# EAGLE design WLAN_Modem (EAGLE 9.6.2)
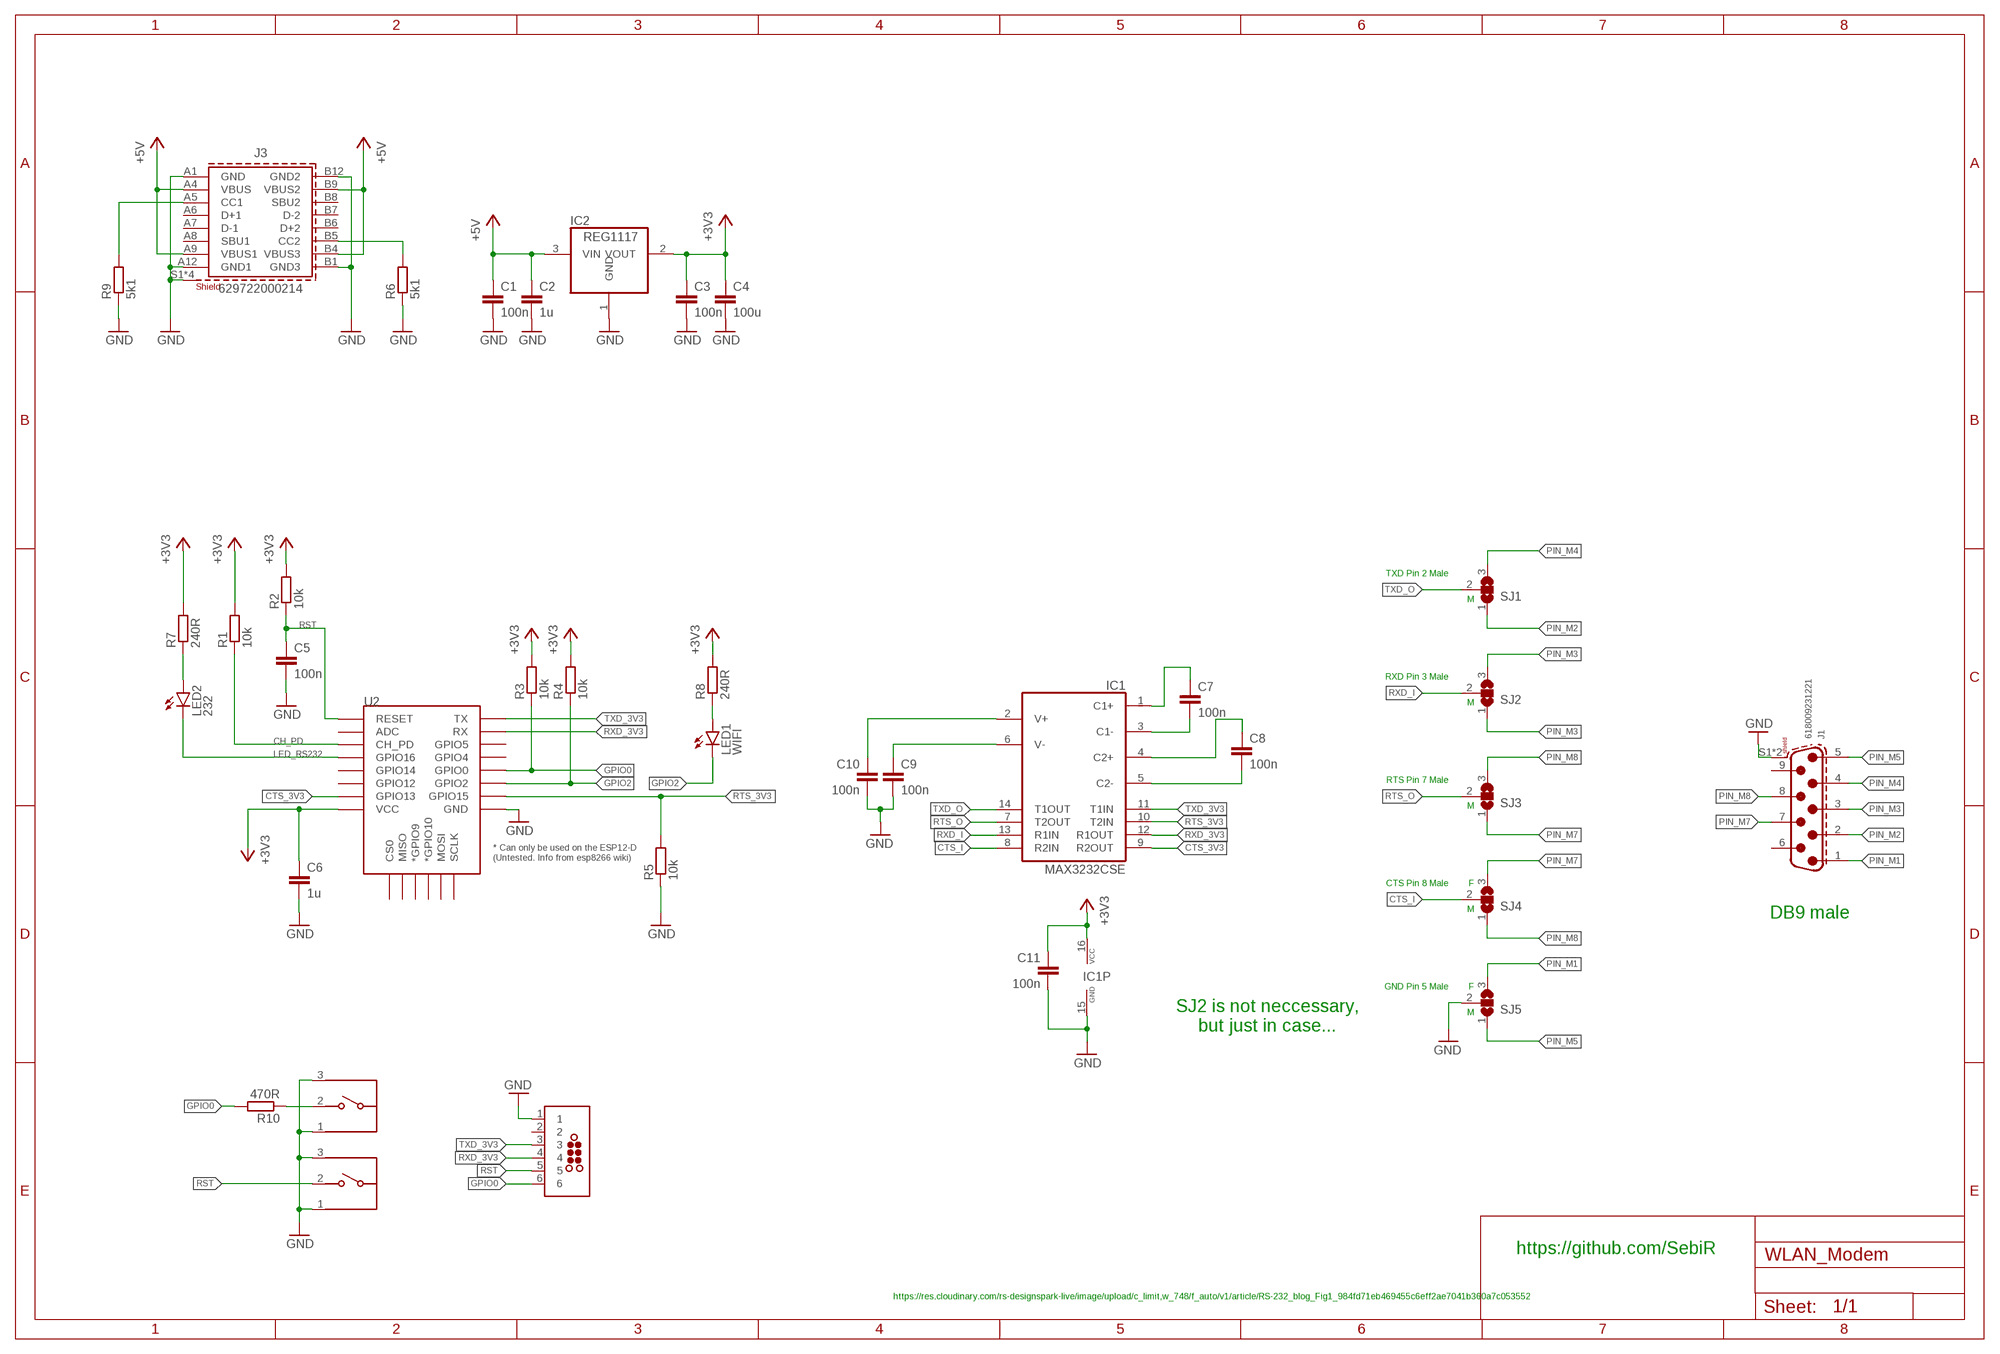
[diagram p0: schematic, sheet 1]

## Parts
C1  100n  C-EUC0603  [C0603]
C2  1u  C-EUC0603  [C0603]
C3  100n  C-EUC0603  [C0603]
C4  100u  C-EUC0603  [C0603]
C5  100n  C-EUC0603  [C0603]
C6  1u  C-EUC0603  [C0603]
C7  100n  C-EUC0603  [C0603]
C8  100n  C-EUC0603  [C0603]
C9  100n  C-EUC0603  [C0603]
C10  100n  C-EUC0603  [C0603]
C11  100n  C-EUC0603  [C0603]
IC1  MAX3232CSE  [SO16]
IC2  REG1117  [SOT223]
J1  618009231221  6180XX231221_618009231221  [618009231221]
J3  629722000214  [629722000214]
J4  TAG-CONNECT_TC2030-MCP-NL  [TAG-CONNECT_TC2030-MCP-NL]
LED1  WIFI  LEDCHIP-LED0603  [CHIP-LED0603]
LED2  232  LEDCHIP-LED0603  [CHIP-LED0603]
R1  10k  R-EU_R0603  [R0603]
R2  10k  R-EU_R0603  [R0603]
R3  10k  R-EU_R0603  [R0603]
R4  10k  R-EU_R0603  [R0603]
R5  10k  R-EU_R0603  [R0603]
R6  5k1  R-EU_R0603  [R0603]
R7  240R  R-EU_R0603  [R0603]
R8  240R  R-EU_R0603  [R0603]
R9  5k1  R-EU_R0603  [R0603]
R10  470R  R-EU_R0603  [R0603]
S1  436333033816  [436333033816]
S2  436333033816  [436333033816]
SJ1  SJ2W  [SJ_2]
SJ2  SJ2W  [SJ_2]
SJ3  SJ2W  [SJ_2]
SJ4  SJ2W  [SJ_2]
SJ5  SJ2W  [SJ_2]
U2  ESP12ESMD  [ESP12E-SMD]

## Nets
+3V3: C3.1 C4.1 C6.1 C11.1 IC1.16(VCC) IC2.2(VOUT) R1.2 R2.2 R3.2 R4.2 R7.2 R8.2 U2.VCC
+5V: C1.1 C2.1 IC2.3(VIN) J3.A4(VBUS) J3.A9(VBUS1) J3.B4(VBUS3) J3.B9(VBUS2)
CH_PD: R1.1 U2.CH_PD
CTS_3V3: IC1.9(R2OUT) U2.GPIO13
CTS_I: IC1.8(R2IN) SJ4.2
GND: C1.2 C2.2 C3.2 C4.2 C5.2 C6.2 C9.2 C10.2 C11.2 IC1.15(GND) IC2.1(GND) J1.S1(SHIELD) J1.S2(SHIELD) J3.A1(GND) J3.A12(GND1) J3.B1(GND3) J3.B12(GND2) J3.S1(SHIELD) J3.S2(SHIELD) J3.S3(SHIELD) J3.S4(SHIELD) J4.1 R5.1 R6.1 R9.1 S1.1 S1.3 S2.1 S2.3 SJ5.2 U2.GND
GPIO0: J4.6 R3.1 R10.2 U2.GPIO0
GPIO2: LED1.C R4.1 U2.GPIO2
LED_RS232: LED2.C U2.GPIO16
N$1: LED1.A R8.1
N$2: J3.A5(CC1) R9.2
N$4: LED2.A R7.1
N$5: J3.B5(CC2) R6.2
N$7: R10.1 S2.2
N$11: C7.2 IC1.3(C1-)
N$15: C7.1 IC1.1(C1+)
N$16: C8.1 IC1.4(C2+)
N$17: C8.2 IC1.5(C2-)
N$18: C10.1 IC1.2(V+)
N$19: C9.1 IC1.6(V-)
PIN_M1: J1.1 SJ5.3
PIN_M2: J1.2 SJ1.1
PIN_M3: J1.3 SJ2.1 SJ2.3
PIN_M4: J1.4 SJ1.3
PIN_M5: J1.5 SJ5.1
PIN_M7: J1.7 SJ3.1 SJ4.3
PIN_M8: J1.8 SJ3.3 SJ4.1
RST: C5.1 J4.5 R2.1 S1.2 U2.RESET
RTS_3V3: IC1.10(T2IN) R5.2 U2.GPIO15
RTS_O: IC1.7(T2OUT) SJ3.2
RXD_3V3: IC1.12(R1OUT) J4.4 U2.RXD0(RX)
RXD_I: IC1.13(R1IN) SJ2.2
TXD_3V3: IC1.11(T1IN) J4.3 U2.TXD0(TX)
TXD_O: IC1.14(T1OUT) SJ1.2
Unconnected: J1.6 J1.9 J3.A6(D+1) J3.A7(D-1) J3.A8(SBU1) J3.B6(D+2) J3.B7(D-2) J3.B8(SBU2) U2.ADC U2.CS0 U2.GPIO4 U2.GPIO5 U2.GPIO9(*GPIO9) U2.GPIO10(*GPIO10) U2.GPIO12 U2.GPIO14 U2.MISO U2.MOSI U2.SCLK

## Notes on the sheet
- TXD Pin 2 Male
- M
- RXD Pin 3 Male
- M
- RTS Pin 7 Male
- M
- CTS Pin 8 Male | F
- M | DB9 male
- GND Pin 5 Male | F
- SJ2 is not neccessary,
  but just in case...
- M
- https://github.com/SebiR
- https://res.cloudinary.com/rs-designspark-live/image/upload/c_limit,w_748/f_auto/v1/article/RS-232_blog_Fig1_984fd71eb469455c6eff2ae7041b360a7c053552

## Power pins joined to a net without a drawn wire
2: J4.2

## Library data of the parts
C1-C11 = rcl:C-EU: CAPACITOR, European symbol; SPICEPREFIX: C
IC1 = maxim:MAX3232*: True RS-232 Transceivers 3.0V to 5.5V, Low-Power up to 1Mbps, Using Four 0.1µF External Capacitors Source: http://pdfserv.maxim-ic.com/en/ds/MAX3222-MAX3241.pdf; MPN: MAX3232CSE; OC_FARNELL: 9725490; OC_NEWARK: 90C2890
IC2 = burr-brown:REG1117: 800mA and 1A Low Dropout (LDO) Positive Regulator 1.8V, 2.5V, 2.85V, 3.3V, 5V, and Adj; MPN: REG1117; OC_FARNELL: 1097566; OC_NEWARK: 14P6981
J1 = Wurth_Connectors_WR-DSUB:6180XX231221_618009231221: WR-DSUB 8.08 mm Male Angled PCB Connector w. Hex Screw Kind Properties Quality Class:3 as per IEC 60 603-13 Gender:Male Type:Angled Insulator Material:PBT Insulator Flammability Rating:UL94 V-0 Color:Black Contact Material:Copper Alloy Contact Plating:Gold Contact Type:Stamped Shielding Material:Steel Shielding Plating:Nickel General Information Operating Temperature:-55 up to +105 °C Compliance:RoHS Electrical Properties IR1:3 A Working Voltage:125 V (AC) Withstanding Voltage:100 V (AC) Contact Resistance:30 mΩ <https://www.we-online.com/catalog/media/o33083v209%20Family_WR-DSUB_6180xx231221.jpg> Details see: www.we-online.com/en/components/products/DSUB_MALE_ANGLED_PCB_CONNECTOR_W_HEX_SCREW_8_08MM_6180XX231221 Updated by Ella Wu 2023-03-21 2023 (C) Würth Elektronik; DATASHEET-URL: https://www.we-online.com/redexpert/spec/618009231221?ae; GENDER: Male; PART-NUMBER: 618009231221; PINS: 9; TYPE: Angled; WE-NUMBER: 618009231221; WORKING-VOLTAGE: 125 V(AC)
J3 = Wurth_Connectors_WR-USB:629722000214: WR-COM USB 2.0 Type C Receptacle Horizontal SMT Kind Properties Durability 10 000 Mating cycles Gender Receptacle Type Horizontal General Information Operating Temperature -40 up to +85 °C Electrical Properties Working Voltage 20 V (DC) Withstanding Voltage 100 V (AC) Contact Resistance 40 mΩ Material Properties Insulator Material LCP Insulator Flammability Rating UL94 V-0 Insulator Color Black Contact Material Brass Contact Plating Gold over Nickel Contact Type Stamped Shielding Material Steel Shielding Plating Nickel (Ni) <https://www.we-online.com/components/media/o689297v209%20family-wr-com-629722000214.jpg> Details see: www.we-online.com/en/components/products/WR-COM_USB_20_TYPE_C_RECEPTACLE_HORIZONTAL_SMT <www.we-online.com/catalog/WR-COM_USB_20_TYPE_C_RECEPTACLE_HORIZONTAL_SMT/?utm_source=eagle_model&utm_medium=description_link&utm_campaign=eisos_eagle> Updated by Ella Wu 2023-05-30 2023 (C) Würth Elektronik; APPLICATION: USB 2.0; DATASHEET-URL: https://www.we-online.com/redexpert/spec/629722000214?ae; GERDER: Receptacle; INTERFACE-TYPE: Type C; IR: 5A; MOUNT: SMT; PACKAGING: Tape and Reel; PART-NUMBER: 629722000214; PINS: 16; TYPE: Horizontal; WORKING-VOLTAGE: 20V(AC)
J4 = Eigene-Rietig:TAG-CONNECT_TC2030: TAG-CONNECT ICSP Connector Manufacturer: Tag-Connect <http://www.tag-connect.com> Cable for easy In-Circuit Serial Programming. Designed for Microchip ICD2, suitable for many others. Two variants - one "with legs" (for hands-free fit on PCB) and another "without legs" for quick programming. PAD Description 1 MCLR/Vpp 2 Vdd 3 GND 4 PGD (ISPDAT) 5 PGC (ISPCLK) 6 nc (used for LVP) ©2009 ROFA.cz - modified and updated by Robert Darlington ‹rdarlington@gmail.com›
LED1 LED2 = led:LED: LED OSRAM: - CHIPLED LG R971, LG N971, LY N971, LG Q971, LY Q971, LO R971, LY R971 LH N974, LH R974 LS Q976, LO Q976, LY Q976 LO Q996 - Hyper CHIPLED LW Q18S LB Q993, LB Q99A, LB R99A - SideLED LS A670, LO A670, LY A670, LG A670, LP A670 LB A673, LV A673, LT A673, LW A673 LH A674 LY A675 LS A676, LA A676, LO A676, LY A676, LW A676 LS A679, LY A679, LG A679 - Hyper Micro SIDELED® LS Y876, LA Y876, LO Y876, LY Y876 LT Y87S - SmartLED LW L88C, LW L88S LB L89C, LB L89S, LG L890 LS L89K, LO L89K, LY L89K LS L896, LA L896, LO L896, LY L896 - TOPLED LS T670, LO T670, LY T670, LG T670, LP T670 LSG T670, LSP T670, LSY T670, LOP T670, LYG T670 LG T671, LOG T671, LSG T671 LB T673, LV T673, LT T673, LW T673 LH T674 LS T676, LA T676, LO T676, LY T676, LB T676, LH T676, LSB T676, LW T676 LB T67C, LV T67C, LT T67C, LS T67K, LO T67K, LY T67K, LW E67C LS E67B, LA E67B, LO E67B, LY E67B, LB E67C, LV E67C, LT E67C LW T67C LS T679, LY T679, LG T679 LS T770, LO T770, LY T770, LG T770, LP T770 LB T773, LV T773, LT T773, LW T773 LH T774 LS E675, LA E675, LY E675, LS T675 LS T776, LA T776, LO T776, LY T776, LB T776 LHGB T686 LT T68C, LB T68C - Hyper Mini TOPLED® LB M676 - Mini TOPLED Santana® LG M470 LS M47K, LO M47K, LY M47K Source: http://www.osram.convergy.de LUXEON: - LUMILED® LXK2-PW12-R00, LXK2-PW12-S00, LXK2-PW14-U00, LXK2-PW14-V00 LXK2-PM12-R00, LXK2-PM12-S00, LXK2-PM14-U00 LXK2-PE12-Q00, LXK2-PE12-R00, LXK2-PE12-S00, LXK2-PE14-T00, LXK2-PE14-U00 LXK2-PB12-K00, LXK2-PB12-L00, LXK2-PB12-M00, LXK2-PB14-N00, LXK2-PB14-P00, LXK2-PB14-Q00 LXK2-PR12-L00, LXK2-PR12-M00, LXK2-PR14-Q00, LXK2-PR14-R00 LXK2-PD12-Q00, LXK2-PD12-R00, LXK2-PD12-S00 LXK2-PH12-R00, LXK2-PH12-S00 LXK2-PL12-P00, LXK2-PL12-Q00, LXK2-PL12-R00 Source: www.luxeon.com KINGBRIGHT: KA-3528ASYC Source: www.kingbright.com
R1-R10 = rcl:R-EU_: RESISTOR, European symbol; SPICEPREFIX: R
S1 S2 = Wurth_Switch_WS-TASU:436333033816: WS-TASU J-Bend SMT Tact Switch with Boss Design 4.5 x 3.4mm side push MATERIAL PROPERTIES Cover Material Copper Alloy PROPERTIES Actuator Material HTN Actuator Flammability Rating UL94 V-0 Actuator Color Black Frame Material HTN Frame Flammability Rating UL94 V-0 Frame Color Black Contact Material Stainless Steel Contact Plating Silver Terminal Material Copper Alloy Terminal Plating Silver VR 12 V (DC) Contact Resistance Initial 500 mΩ Contact Resistance After Life Test 2 Ω RISO 100 MΩ Withstanding Voltage 250 V (AC) Washable No Mechanical Properties Electrical Life 100000 Cycles Stroke (Value) 0.2 mm GENERAL INFORMATION Operating Temperature -40 up to +85 °C Washable No PACKAGING PROPERTIES Packaging Tape and Reel <https://www.we-online.de/katalog/media/o64618v209%20Family_WS-TASU_J-Bend_SMD_Tact_Switch_with_boss_design_436353045816.jpg> Details see: https://www.we-online.de/katalog/en/WS-TASU_J-BEND_SMT_TACT_SWITCH_SIDE_PUSH Updated by Ella Wu 2021-01-25 2021(C) Wurth Elektronik; DATASHEET-URL: https://www.we-online.com/catalog/datasheet/436333033816.pdf; H: 3.3mm; OPERATION-FORCE: 160g; PART-NUMBER: 436333033816
SJ1-SJ5 = jumper:SJ2W: SMD solder JUMPER
U2 = ESP8266_Modules:ESP12E: ESP12E Module

## Board
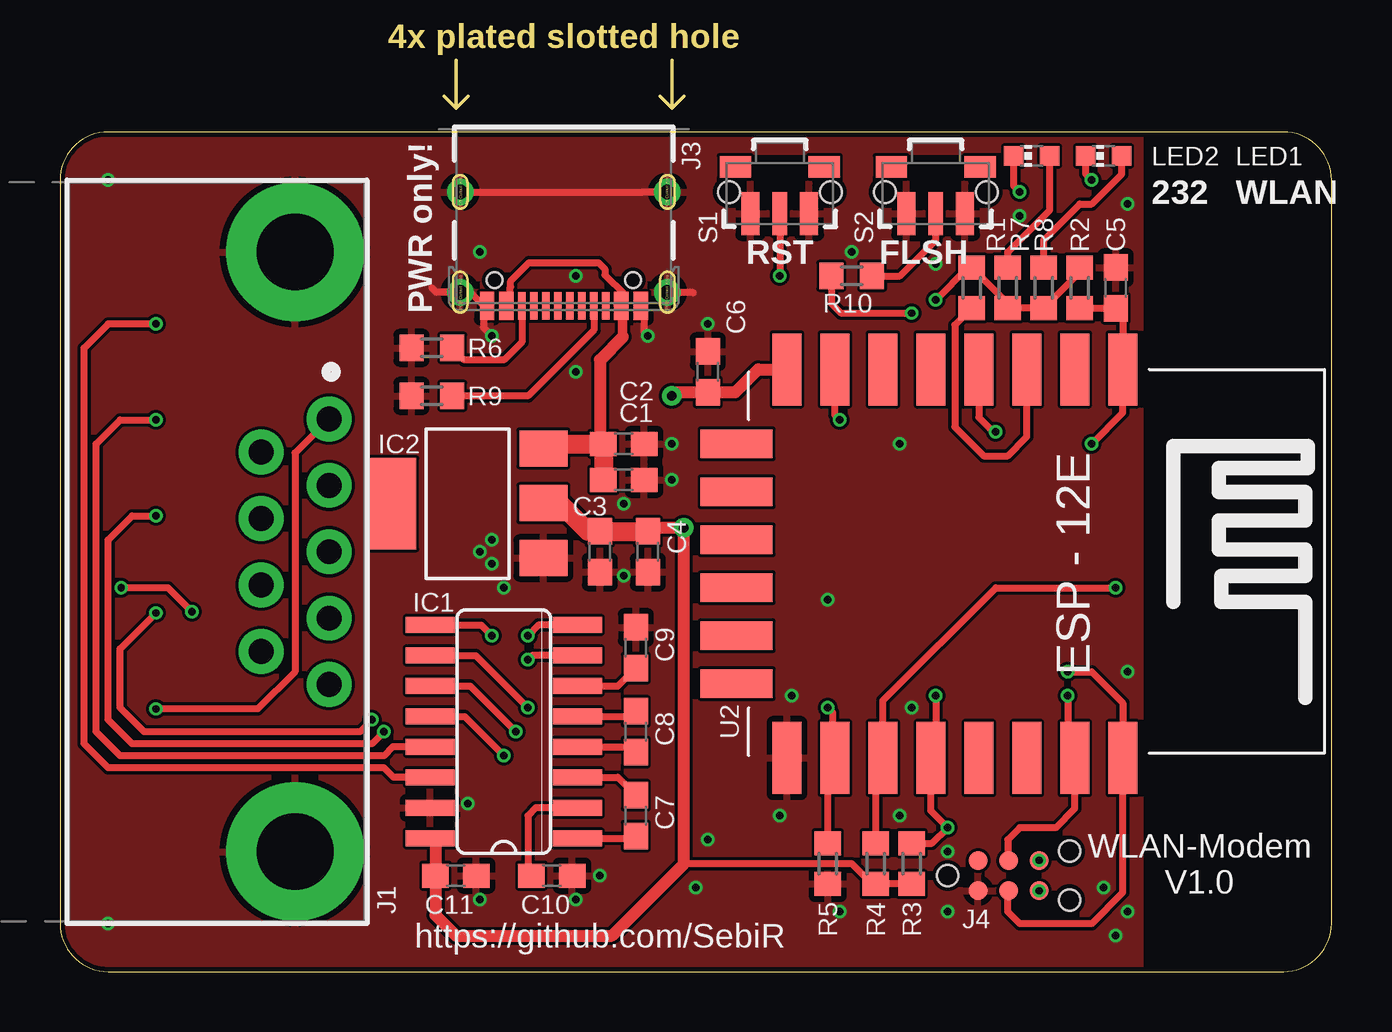
[diagram p1: board, top side]
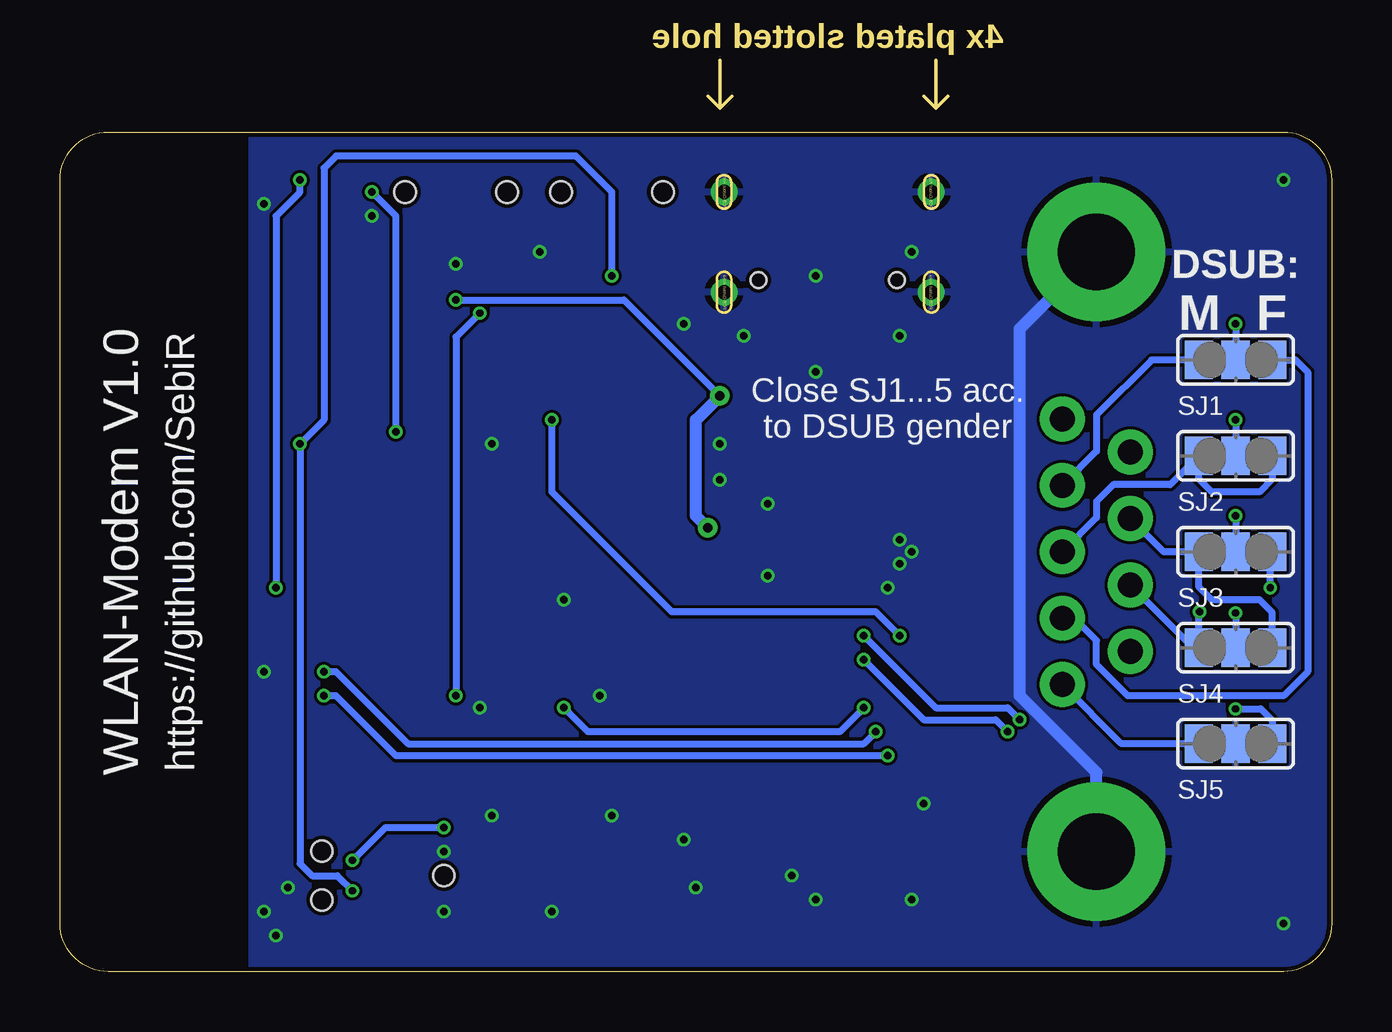
[diagram p2: board, bottom side, seen from below]

Size 53 x 38 mm. Coordinates in mm from the lower left corner, seen from the top.
Outline: 16.5,38 16.5,36
Outline: 16.5,36 16,36.5
Outline: 17,36.5 16.5,36
Outline: 25.5,36 25,36.5
Outline: 26,36.5 25.5,36
Outline: 25.5,38 25.5,36
Outline: 2,0 51,0 arc90 53,2 53,33 arc90 51,35 2,35 arc90 0,33 0,2 arc90 2,0
Copper layers (1*16): Top 0.035mm / dielectric 1.6mm / Bottom 0.035mm
Design rules "jlcpcb-2layers": minimum track width 0.2mm, minimum drill 0.3mm, track to track 5mil, track to pad 5mil, pad to pad 5mil, via to via 5mil, smd to smd 5mil, copper to edge 0.2mm, drill to drill 6mil, minimum pad ring 10mil, minimum via ring 0.125mm, stop-mask expansion 4mil, vias tented up to drill 0.5mm, thermal gap 10mil

### Footprints (pad centres in the part's own frame; a part is rotated, then mirrored left to right if it is on the bottom)
C0603 = smd 1.1 x 1: 1 -0.85,0; 2 0.85,0
SO16 = smd 0.66 x 2.032: 1 -4.445,-3.073; 2 -3.175,-3.073; 3 -1.905,-3.073; 4 -0.635,-3.073; 5 0.635,-3.073; 6 1.905,-3.073; 7 3.175,-3.073; 8 4.445,-3.073; 9 4.445,3.073; 10 3.175,3.073; 11 1.905,3.073; 12 0.635,3.073; 13 -0.635,3.073; 14 -1.905,3.073; 15 -3.175,3.073; 16 -4.445,3.073
SOT223 = smd 1.499 x 2.007: 1 -2.261,-3.15; 2 0.025,-3.15; 3 2.311,-3.15 | smd 3.81 x 2.007: 4 0,3.15
618009231221 = drill 1.04: 1 -5.54,7.72; 2 -2.77,7.72; 3 0,7.72; 4 2.77,7.72; 5 5.54,7.72; 6 -4.155,4.88; 7 -1.385,4.88; 8 1.385,4.88; 9 4.155,4.88 | drill 3.2: S1 -12.5,6.3; S2 12.5,6.3
629722000214 = smd 0.3 x 1.15: A1 -3.35,4.745; A4 -2.55,4.745; A5 -1.25,4.745; A6 -0.25,4.745; A7 0.25,4.745; A8 1.25,4.745; A9 2.55,4.745; A12 3.35,4.745; B1 3.05,4.745; B4 2.25,4.745; B5 1.75,4.745; B6 0.75,4.745; B7 -0.75,4.745; B8 -1.75,4.745; B9 -2.25,4.745; B12 -3.05,4.745 | drill 0.6 pad 1: S1 -4.32,4.18; S2 4.32,4.18; S3 -4.32,0; S4 4.32,0 | hole 0.65: -2.89,3.68; 2.89,3.68
TAG-CONNECT_TC2030-MCP-NL = smd 0.787 x 0.787: 1 1.27,-0.635; 2 1.27,0.635; 3 2.54,-0.635; 4 2.54,0.635; 5 3.81,-0.635; 6 3.81,0.635 | hole 0.889: 0,0; 5.08,-1.016; 5.08,1.016
CHIP-LED0603 = smd 0.8 x 0.8: A 0,-0.75; C 0,0.75
R0603 = smd 1 x 1.1: 1 -0.85,0; 2 0.85,0
436333033816 = smd 0.75 x 1.8: 1 -1.225,0.9; 3 1.225,0.9 | smd 0.6 x 1.8: 2 0,0.9 | smd 1.3 x 0.9: Z1 -1.85,-1.05; Z2 1.85,-1.05 | hole 0.9: -2.125,0; 2.125,0
SJ_2 = smd 1.168 x 1.6: 1 -1.524,0; 2 0,0; 3 1.524,0
ESP12E-SMD = smd 3 x 1.2: ADC -8.1,3.8; CH_PD -8.1,1.8; GND 8.1,-8.2; GPIO0 8.1,-2.2; GPIO2 8.1,-4.2; GPIO4 8.1,-0.2; GPIO5 8.1,1.8; GPIO12 -8.1,-4.2; GPIO13 -8.1,-6.2; GPIO14 -8.1,-2.2; GPIO15 8.1,-6.2; GPIO16 -8.1,-0.2; RESET -8.1,5.8; RXD0 8.1,3.8; TXD0 8.1,5.8; VCC -8.1,-8.2 | smd 1.2 x 3: CS0 -5,-10.3; GPIO9 -1,-10.3; GPIO10 1,-10.3; MISO -3,-10.3; MOSI 3,-10.3; SCLK 5,-10.3

### Placement (x,y rotation side)
C1  23.5,20.5 0 top
C2  23.5,22 0 top
C3  22.5,17.5 270 top
C4  24.5,17.5 270 top
C5  44,28.5 90 top
C6  27,25 90 top
C7  24,6.5 90 top
C8  24,10 90 top
C9  24,13.5 90 top
C10  20.5,4 0 top
C11  16.5,4 0 top
IC1  18.5,10 90 top
IC2  17,19.5 90 top
J1  3.5,17.5 270 top
J3  21,32.5 180 top
J4  37,4 0 top
LED1  43.5,34 90 top
LED2  40.5,34 90 top
R1  38,28.5 90 top
R2  42.5,28.5 90 top
R3  35.5,4.5 270 top
R4  34,4.5 270 top
R5  32,4.5 90 top
R6  15.5,26 0 top
R7  39.5,28.5 270 top
R8  41,28.5 270 top
R9  15.5,24 0 top
R10  33,29 180 top
S1  30,32.5 180 top
S2  36.5,32.5 180 top
SJ1  4,25.5 0 bottom
SJ2  4,21.5 0 bottom
SJ3  4,17.5 0 bottom
SJ4  4,13.5 0 bottom
SJ5  4,9.5 0 bottom
U2  38.5,17 270 top

### Tracks (layer width: path | path; a pad name or v marks a point on that pad's centre or on a via)
+3V3  (via drill 0.3, 0.4 pad 0.8)
  Top 0.3: R3.2 R4.2 33.85,3.65 33,4.5 26,4.5 | v36.5,28 37.85,29.35 R1.2 39.5,27.85 R7.2 R8.2 42.5,29.15 R2.2
  Top 0.5: IC1.16 15.65,5.33 C11.1 15.65,2.35 16.5,1.5 23,1.5 26,4.5 v26,18.5 24.5,18.5 C4.1 | v25.5,24 25.65,24.15 C6.1 28.15,24.15 29.1,25.1 U2.VCC
  Top 0.8: C4.1 C3.1 22,18.35 20.82,19.52 IC2.2
  Bottom 0.3: v25.5,24 29.5,28 v36.5,28
  Bottom 0.5: v26,18.5 26.5,19 26.5,23 v25.5,24
+5V
  Top 0.3: J3.A9 J3.B4 18.75,28.5 18.79,28.54 18.79,28.79 19.55,29.55 22.45,29.55 22.71,29.29 22.71,29.04 23.5,28.25 23.5,27.75 | J3.B9 23.35,27.75 23.5,27.61 23.5,27.75 | 23.5,27.75 J3.A4
  Top 0.4: J3.B9 23.45,27.55 23.45,26.45
  Top 0.5: 23.45,26.45 22.5,25.5 22.5,22.15 C2.1
  Top 0.8: C1.1 C2.1 20.34,22 IC2.3
CH_PD
  Top 0.3: R1.1 37.3,26.95 37.3,22.7 38.5,21.5 39.5,21.5 40.3,22.3 U2.CH_PD
CTS_3V3  (via drill 0.3)
  Top 0.3: IC1.9 17.55,14.45 v18,14 | v32.5,23 32.3,23.2 U2.GPIO13
  Bottom 0.3: v18,14 19,15 27.5,15 32.5,20 v32.5,23
CTS_I  (via drill 0.3)
  Top 0.3: IC1.8 19.95,14.45 v19.5,14 | v13,10.5 12.5,10 3.5,10 2.5,11 2.5,13.45 v4,14.95
  Bottom 0.3: v19.5,14 16.5,11 13.5,11 v13,10.5 | v4,14.95 SJ4.2
GND  (via drill 0.3)
  Top 0.3: v18,26.5 17.65,26.85 J3.A12 17.09,28.32 J3.S2 15.68,28.32 15.5,28.5 | J3.A1 24.35,26.65 v24.5,26.5 | J3.S4 24.3,32.5 | J3.S3 24.4,32.5 | J3.S1 26.38,28.32 26.4,28.3
  Bottom 0.5: J1.S2 9.8,8.3 13,11.5 13,26.8 J1.S1
  other vias: 2,2 2,33 44.5,32 18,17 18,18 17.5,17.5 32,15.5 25.5,20.5 25.5,22 23.5,19.5 27,27 30,6.5 30.5,11.5 43.5,3.5 44.5,2.5 17.5,3 21.5,3 17,7 37,2.5 32.5,2.5 18.5,16 23.5,16.5 22.5,4 17.5,30 21.5,29 44.5,12.5 40,31.5 36.5,29.5 33,30 35,22 35.5,11 35,6.5 37,5 44,1.5 26.5,3.5 27,5.5 21.5,25
  pour Top: 0,2 0,33 arc-90 2,35 45,35 45,0 2,0 arc-90
  pour Bottom: 45,0 45,35 2,35 arc90 0,33 0,2 arc90 2,0
GPIO0  (via drill 0.3)
  Top 0.3: 36.3,8.5 36.3,6.7 v37,6 36.35,5.35 R3.1 | 36.3,8.5 U2.GPIO0 | R10.2 32.15,27.85 32.55,27.45 v35.5,27.45 | v36.5,11.5 36.5,8.7 36.3,8.5
  Bottom 0.3: v37,6 39.45,6 J4.6 | v35.5,27.45 36.5,26.45 v36.5,11.5
  other vias: 40.81,4.63
GPIO2  (via drill 0.3)
  Top 0.3: R4.1 34,8.6 U2.GPIO2 34.3,11.3 39,16 v44,16 | v43,33 42.75,33.25 LED1.C
  Bottom 0.3: v43,33 43,32.5 44,31.5 v44,16
LED_RS232  (via drill 0.3)
  Top 0.3: v39,22.5 38.9,22.5 38.3,23.1 U2.GPIO16 | v40,32.5 39.75,32.75 LED2.C
  Bottom 0.3: v39,22.5 39,31.5 v40,32.5
N$1
  Top 0.3: LED1.A 44.25,33.25 43,32 42.5,32 41,30.5 R8.1
N$2
  Top 0.3: J3.A5 22.25,26.75 19.5,24 R9.2
N$4
  Top 0.3: R7.1 39.5,30 41.25,31.75 LED2.A
N$5
  Top 0.3: J3.B5 19.25,26.25 18.5,25.5 16.85,25.5 R6.2
N$7
  Top 0.3: R10.1 35,29 36.5,30.5 S2.2
N$11
  Top 0.3: IC1.3 23.25,8.1 C7.2
N$15
  Top 0.3: IC1.1 23.91,5.55 C7.1
N$16
  Top 0.3: IC1.4 23.79,9.37 C8.1
N$17
  Top 0.3: IC1.5 23.79,10.63 C8.2
N$18
  Top 0.3: IC1.2 19.82,6.83 19.5,6.5 19.5,4.15 C10.1
N$19
  Top 0.3: IC1.6 23.25,11.9 C9.1
PIN_M1  (via drill 0.3)
  Top 0.3: J1.1 9.8,21.62 9.8,12.5 8.25,10.95 v4,10.95
  Bottom 0.3: v4,10.95 2.95,10.95 2.48,10.48 SJ5.3
PIN_M2
  Bottom 0.3: SJ1.1 7.5,25.5 9.8,23.2 9.8,21.69 J1.2
PIN_M3
  Bottom 0.3: J1.3 9.8,18.92 9.8,19.6 9.1,20.3 6.72,20.3 SJ2.1 5.52,20.52 5,20 3,20 2.48,20.52 SJ2.3
PIN_M4
  Bottom 0.3: SJ1.3 1.5,25.5 1,25 1,12.5 2,11.5 8.5,11.5 9.8,12.8 9.8,13.8 10.73,14.73 J1.4
PIN_M5
  Bottom 0.3: SJ5.1 8.76,9.5 J1.5
PIN_M7
  Bottom 0.3: J1.7 7,17.5 SJ3.1 5.52,16.02 5,15.5 3,15.5 2.48,14.98 SJ4.3
PIN_M8  (via drill 0.3)
  Top 0.3: v5.5,15 4.5,16 v2.55,16
  Bottom 0.3: J1.8 5.76,13.5 SJ4.1 5.52,14.98 v5.5,15 | v2.55,16 2.55,17.42 SJ3.3
RST  (via drill 0.3)
  Top 0.3: S1.2 v30,29 | R2.1 C5.1 44.3,27.35 U2.RESET 44.3,23.3 v43,22
  Bottom 0.3: J4.5 41.45,4 42.5,4 43,4.5 v43,22 42,23 42,33.5 41.5,34 31.5,34 30,32.5 v30,29
  other vias: 40.81,3.37
RTS_3V3  (via drill 0.3)
  Top 0.3: 32.2,8.8 U2.GPIO15 | IC1.10 17.32,13.18 v19.5,11 | v32,11 32.2,10.8 32.2,8.8 | 32.2,8.8 32,8.6 R5.2
  Bottom 0.3: v19.5,11 20.5,10 31,10 v32,11
RTS_O  (via drill 0.3)
  Top 0.3: IC1.7 19.68,13.18 v19.5,13 | v13.5,10 13,9.5 3,9.5 2,10.5 2,18 3,19 v4,19
  Bottom 0.3: v19.5,13 17,10.5 14,10.5 v13.5,10 | v4,19 SJ3.2
RXD_3V3  (via drill 0.3)
  Top 0.3: IC1.12 16.86,10.63 v18.5,9 | v42,11.5 42,9.2 U2.RXD0 42.3,6.8 41.5,6 40,6 39.5,5.5 39.5,4.67 J4.4
  Bottom 0.3: v18.5,9 39,9 41.5,11.5 v42,11.5
RXD_I  (via drill 0.3)
  Top 0.3: IC1.13 13.87,9.37 13.5,9 2.5,9 1.5,10 1.5,22 2.5,23 v4,23
  Bottom 0.3: v4,23 SJ2.2
TXD_3V3  (via drill 0.3)
  Top 0.3: IC1.11 17.09,11.9 v19,10 | v42,12.5 43,12.5 44.3,11.2 U2.TXD0 44.3,3.3 43,2 40,2 39.5,2.5 39.5,3.33 J4.3
  Bottom 0.3: v19,10 19.5,9.5 38.5,9.5 41.5,12.5 v42,12.5
TXD_O  (via drill 0.3)
  Top 0.3: IC1.14 13.9,8.1 13.5,8.5 2,8.5 1,9.5 1,26 2,27 v4,27
  Bottom 0.3: v4,27 SJ1.2

### Text on the board
Dimension: 4x plated slotted hole
tPlace: 232 | WLAN | PWR only! | RST | FLSH | WLAN-Modem / V1.0 | https://github.com/SebiR
bPlace: DSUB: | F | M | Close SJ1...5 acc. / to DSUB gender | https://github.com/SebiR | WLAN-Modem V1.0